# EAGLE design RPinstrumentationAmp1 (EAGLE 9.7.0)
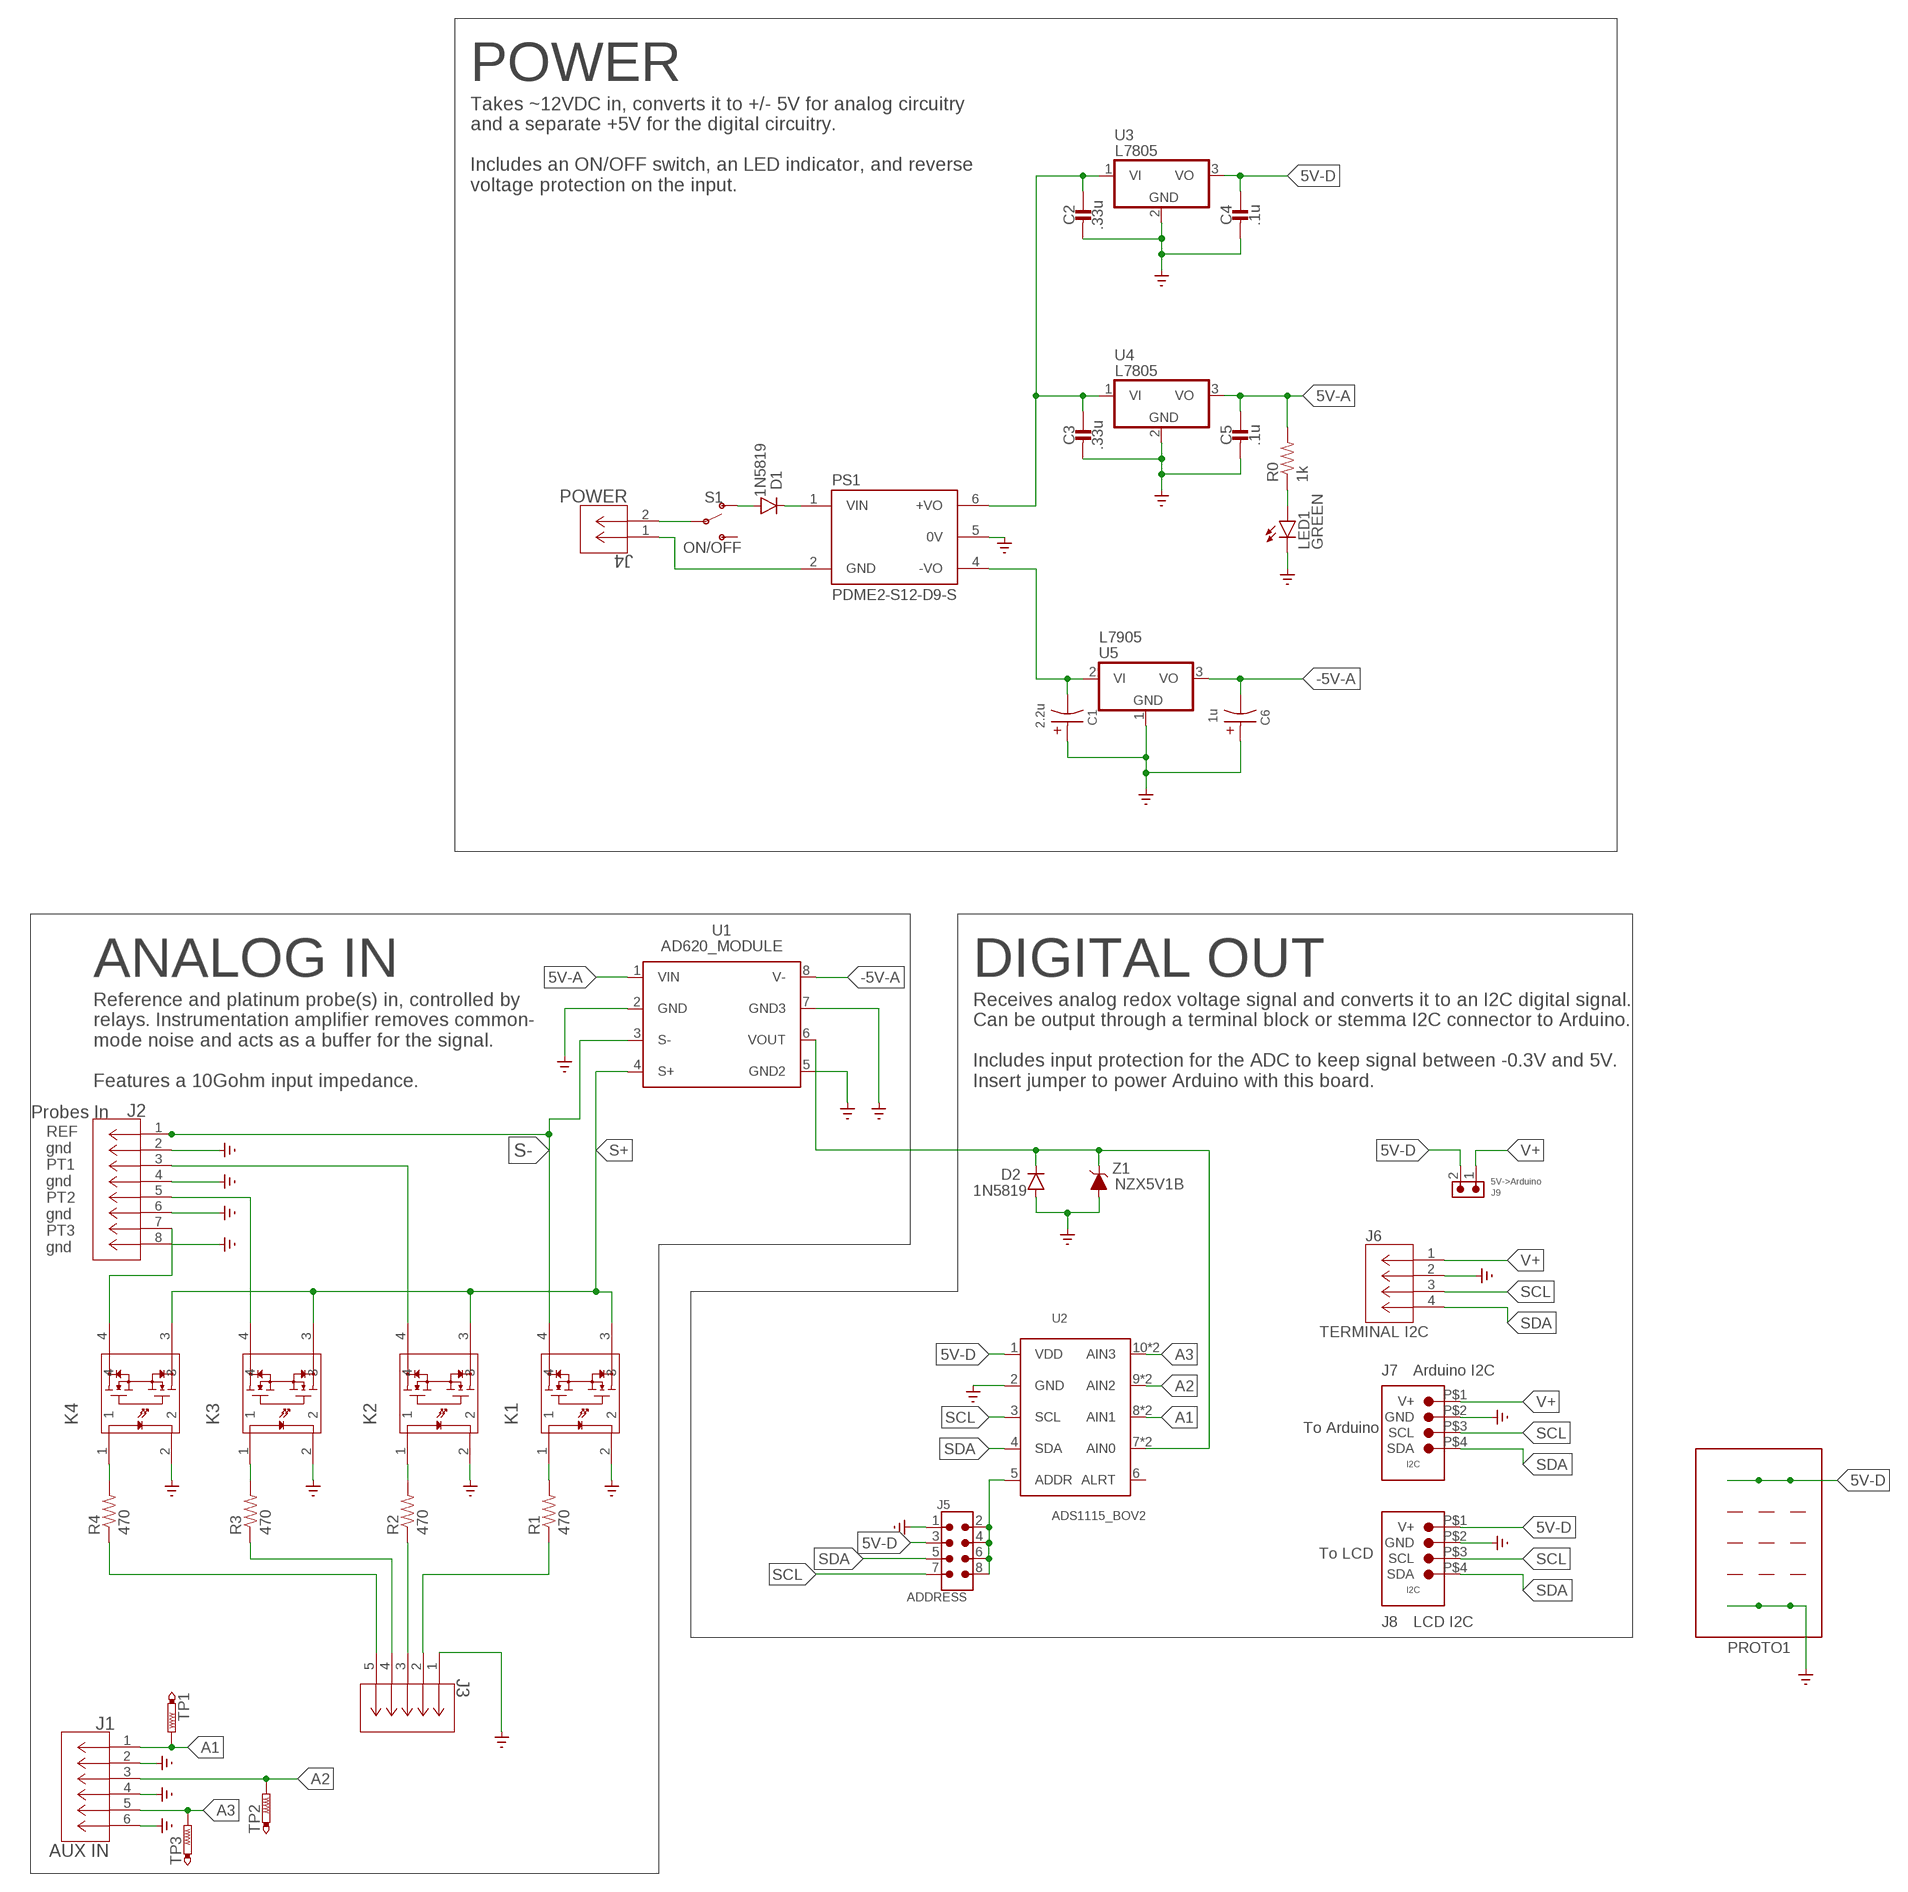
[diagram p0: schematic, sheet 1]

## Parts
C1  2.2u  CAP_POLAR_TH5MM  [E2,5-5]
C2  .33u  CAP-TH-CERAMIC  [THCAPCERAMIC]
C3  .33u  CAP-TH-CERAMIC  [THCAPCERAMIC]
C4  .1u  CAP-TH-CERAMIC  [THCAPCERAMIC]
C5  .1u  CAP-TH-CERAMIC  [THCAPCERAMIC]
C6  1u  CAP_POLAR_TH5MM  [E2,5-5]
D1  1N5819  DIODE-TH  [DIODE-TH]
D2  1N5819  DIODE-TH  [DIODE-TH]
J1  AUX IN  6PIN_TERMINAL_5MM  [6PIN_TERMINAL_5MM]
J2  Probes In  8PIN_TERMINAL_5MM  [8PIN_TERMINAL_5MM]
J3  5PIN_TERMINAL_5MM  [5PIN_TERMINAL_5MM]
J4  POWER  2PIN_TERMINAL_5MM  [CONN2_710002_WRE]
J5  ADDRESS  6130XX21121_61300821121  [61300821121]
J6  TERMINAL I2C  4PIN_TERMINAL_5MM  [4PIN_TERMINAL_5MM]
J7  Arduino I2C  JST_PH_4PIN_STEMMA  [JST_PH_4PIN]
J8  LCD I2C  JST_PH_4PIN_STEMMA  [JST_PH_4PIN]
J9  5V->Arduino  1X2MALEPIN  [61300211121]
K1  G3VM-61A1A-DIP4_THD_OMR  [A-DIP4_THD_OMR]
K2  G3VM-61A1A-DIP4_THD_OMR  [A-DIP4_THD_OMR]
K3  G3VM-61A1A-DIP4_THD_OMR  [A-DIP4_THD_OMR]
K4  G3VM-61A1A-DIP4_THD_OMR  [A-DIP4_THD_OMR]
LED1  GREEN  LED-TH(5MM)  [LED-5MM-TH]
PROTO1  PROTO_AREA_5X3  [PROTO_AREA_5X3]
PS1  PDME2-S12-D9-S  [CONV_PDME2-S12-D9-S]
R0  1k  RESISTOR-TH  [THRESISTOR]
R1  470  RESISTOR-TH  [THRESISTOR]
R2  470  RESISTOR-TH  [THRESISTOR]
R3  470  RESISTOR-TH  [THRESISTOR]
R4  470  RESISTOR-TH  [THRESISTOR]
S1  ON/OFF  SPDT_TT11_TH  [TT11_SPDT]
TP1  PTR1PAD1-13  [P1-13]
TP2  PTR1PAD1-13  [P1-13]
TP3  PTR1PAD1-13  [P1-13]
U1  AD620_MODULE  [AD620_MODULE]
U2  ADS1115_BOV2  [ADS1115_V2]
U3  L7805  7805TV  [TO220V]
U4  L7805  7805TV  [TO220V]
U5  L7905  L79REGULATORTO220V  [TO220V]
Z1  NZX5V1B  ZENER  [DIODE-TH]

## Nets
5V-A: C5.C1 R0.R2 U1.1(VIN) U4.3(VO)
5V-D: C4.C1 J5.3 J8.P$1(V+) J9.2 PROTO1.1 PROTO1.2 PROTO1.3 U2.1(VDD) U3.3(VO)
-5V-A: C6.- U1.8(V-) U5.3(VO)
A1: J1.1 TP1.TP U2.8(AIN1) U2.A1(AIN1)
A2: J1.3 TP2.TP U2.9(AIN2) U2.A2(AIN2)
A3: J1.5 TP3.TP U2.10(AIN3) U2.A3(AIN3)
GND: C1.+ C2.C2 C3.C2 C4.C2 C5.C2 C6.+ D2.P$1(A) J1.2 J1.4 J1.6 J2.2 J2.4 J2.6 J2.8 J3.1 J5.1 J6.2 J7.P$2(GND) J8.P$2(GND) K1.2 K2.2 K3.2 K4.2 LED1.K(C) PROTO1.13 PROTO1.14 PROTO1.15 PS1.5(0V) U1.2(GND) U1.5(GND2) U1.7(GND3) U2.2(GND) U3.2(GND) U4.2(GND) U5.1(GND) Z1.P$1(A) ; supply symbol labelled SUPPLY0_GND_
N$1: D2.P$2(C) U1.6(VOUT) U2.7(AIN0) U2.A0(AIN0) Z1.P$2(C)
N$2: C1.- PS1.4(-VO) U5.2(VI)
N$3: D1.P$2(C) PS1.1(VIN)
N$4: J4.1 PS1.2(GND)
N$5: J2.7 K4.4
N$6: J2.5 K3.4
N$7: C2.C1 C3.C1 PS1.6(+VO) U3.1(VI) U4.1(VI)
N$8: J4.2 S1.P$2(C)
N$9: LED1.A R0.R1
N$10: D1.P$1(A) S1.P$1
N$11: J2.3 K2.4
N$12: K4.1 R4.R2
N$13: J5.2 J5.4 J5.6 J5.8 U2.5(ADDR)
N$14: J3.5 R4.R1
N$15: K3.1 R3.R2
N$16: J3.4 R3.R1
N$17: K2.1 R2.R2
N$18: J3.3 R2.R1
N$19: J3.2 R1.R1
N$20: K1.1 R1.R2
S+: K1.3 K2.3 K3.3 K4.3 U1.4(S+)
S-: J2.1 K1.4 U1.3(S-)
SCL: J5.7 J6.3 J7.P$3(SCL) J8.P$3(SCL) U2.3(SCL)
SDA: J5.5 J6.4 J7.P$4(SDA) J8.P$4(SDA) U2.4(SDA)
V+: J6.1 J7.P$1(V+) J9.1
Unconnected: PROTO1.4 PROTO1.5 PROTO1.6 PROTO1.7 PROTO1.8 PROTO1.9 PROTO1.10 PROTO1.11 PROTO1.12 S1.P$3 U2.6(ALRT)

## Notes on the sheet
- POWER
- Takes ~12VDC in, converts it to +/- 5V for analog circuitry 
  and a separate +5V for the digital circuitry. 
  
  Includes an ON/OFF switch, an LED indicator, and reverse 
  voltage protection on the input.
- ANALOG IN | DIGITAL OUT
- Reference and platinum probe(s) in, controlled by 
  relays. Instrumentation amplifier removes common-
  mode noise and acts as a buffer for the signal.
  
  Features a 10Gohm input impedance.
- Receives analog redox voltage signal and converts it to an I2C digital signal.
  Can be output through a terminal block or stemma I2C connector to Arduino.
  
  Includes input protection for the ADC to keep signal between -0.3V and 5V.
  Insert jumper to power Arduino with this board.
- REF
  gnd
  PT1
  gnd
  PT2
  gnd
  PT3
  gnd
- To Arduino
- To LCD

## Library data of the parts
C1 C6 = !Redox:CAP_POLAR_TH: Elecrolytic Cap, TH
C2-C5 = !Redox:CAP-TH-CERAMIC: Capacitor through-hole ceramic
D1 D2 = !Redox:DIODE-TH: Diode through-hole
J1 = !Redox:6PIN_TERMINAL_5MM: 6 Pin Screw Terminal Block, 5mm pitch
J2 = !Redox:8PIN_TERMINAL_5MM: 8 Pin Screw Terminal Block, 5mm pitch
J3 = !Redox:5PIN_TERMINAL_5MM
J4 = !Redox:2PIN_TERMINAL_5MM; COPYRIGHT: Copyright (C) 2023 Ultra Librarian. All rights reserved.; MANUFACTURER_PART_NUMBER: 691137710002; MFR_NAME: Wurth Electronics
J5 = Wurth_Connectors_WR-PHD:6130XX21121_61300821121: WR-PHD 2.54 mm THT Dual Pin Header ARTICLE PROPERTIES: Pins:4;​ 6;​ 8;​ 10;​ 12;​ 14;​ 16;​ 18;​ 20;​ 22;​ 24;​ 26;​ 28;​ 30;​ 32;​ 34;​ 36;​ 40;​ 44;​ 64;​ 72;​ 80 KIND PROPERTIES: Pitch：2.54 mm Quality Class:3 as per CECC 75 301-802 Rows：Dual Gender：Pin Header Type：Board Stacker MATERIAL PROPERTIES: Insulator Material :PA6T Insulator Flammability Rating:UL94 V-0 Contact Material:Copper Alloy Contact Plating:Gold Contact Type:Stamped GENERAL INFORMATION Operating Temperature:-40 up to +105 °C Compliance:Lead free / RoHS ELECTRICAL PROPERTIES: Rated Current:3 A IR 1:3 A Withstanding Voltage:500 V (AC) Contact Resistance:20 mΩ RISO:1000 MΩ CERTIFICATION UL Approval:E323964 PACKAGING PROPERTIES Packaging:Bag <https://katalog.we-online.com/media/images/v2/o33215v209%20Family_WR-PHD_6130xx21121.jpg> Details see: https://katalog.we-online.com/en/em/PHD_2_54_THT_DUAL_PIN_HEADER_6130XX21121 Updated by Yingchun,Shan 2019-10-16 2019 (C) Würth Elektronik; DATASHEET-URL: https://www.we-online.com/catalog/datasheet/61300821121.pdf; GENDER: Pin Header; IR: 3A; MOUNT: THT; PACKAGING: Bag; PART-NUMBER: 61300821121; PINS: 8; PITCH: 2.54mm; ROWS: Dual; TYPE: Board Stacker; VALUE: 61300821121
J6 = !Redox:4PIN_TERMINAL_5MM: 4 Pin Terminal Block, 5mm pitch
J7 J8 = !Redox:JST_PH_4PIN_STEMMA: STEMMA 4 pin connector for I2C communication V+ GND SCL DSA
J9 = !Redox:1X2MALEPIN: 1x2 pin header 2.54mm pitch
K1-K4 = G3VM-61A1D1_Library_SSR:G3VM-61A1; COPYRIGHT: Copyright (C) 2024 Ultra Librarian. All rights reserved.; MANUFACTURER_PART_NUMBER: G3VM-61A1; MFR_NAME: Omron
LED1 = !Redox:LED-TH(5MM): LED 5mm through hole
PROTO1 = !Redox:PROTO_AREA_5X3: 5x3 Prototyping Area
PS1 = PDME2-S12-D9-S:PDME2-S12-D9-S; MANUFACTURER: CUI Inc; MAXIMUM_PACKAGE_HEIGHT: 10.41 mm; PARTREV: 1.0; STANDARD: Manufacturer Recommendations
R0 R1-R4 = !Redox:RESISTOR-TH: Through-hole Resistor
S1 = !Redox:SPDT_TT11_TH: TT11 DPST toggle switch, Through-Hole
TP1-TP3 = testpad:PTR1: TEST PIN
U1 = !Redox:AD620_MODULE: AD620 Instumentation Amplifier Module (breakout board)
U2 = !Redox:ADS1115_BO: ADS1115 breakout board. 16-bit ADC, 1x10 through hole (pin header)
U3 U4 = !Redox:78*: Positive VOLTAGE REGULATOR Source: http://cache.national.com/ds/LM/LM78L05.pdf http://www.fairchildsemi.com/ds/LM/LM7805.pdf
U5 = !Redox:L79*REGULATOR: Negative VOLTAGE REGULATOR
Z1 = !Redox:ZENER: Zener Diode, Through-Hole

## Board
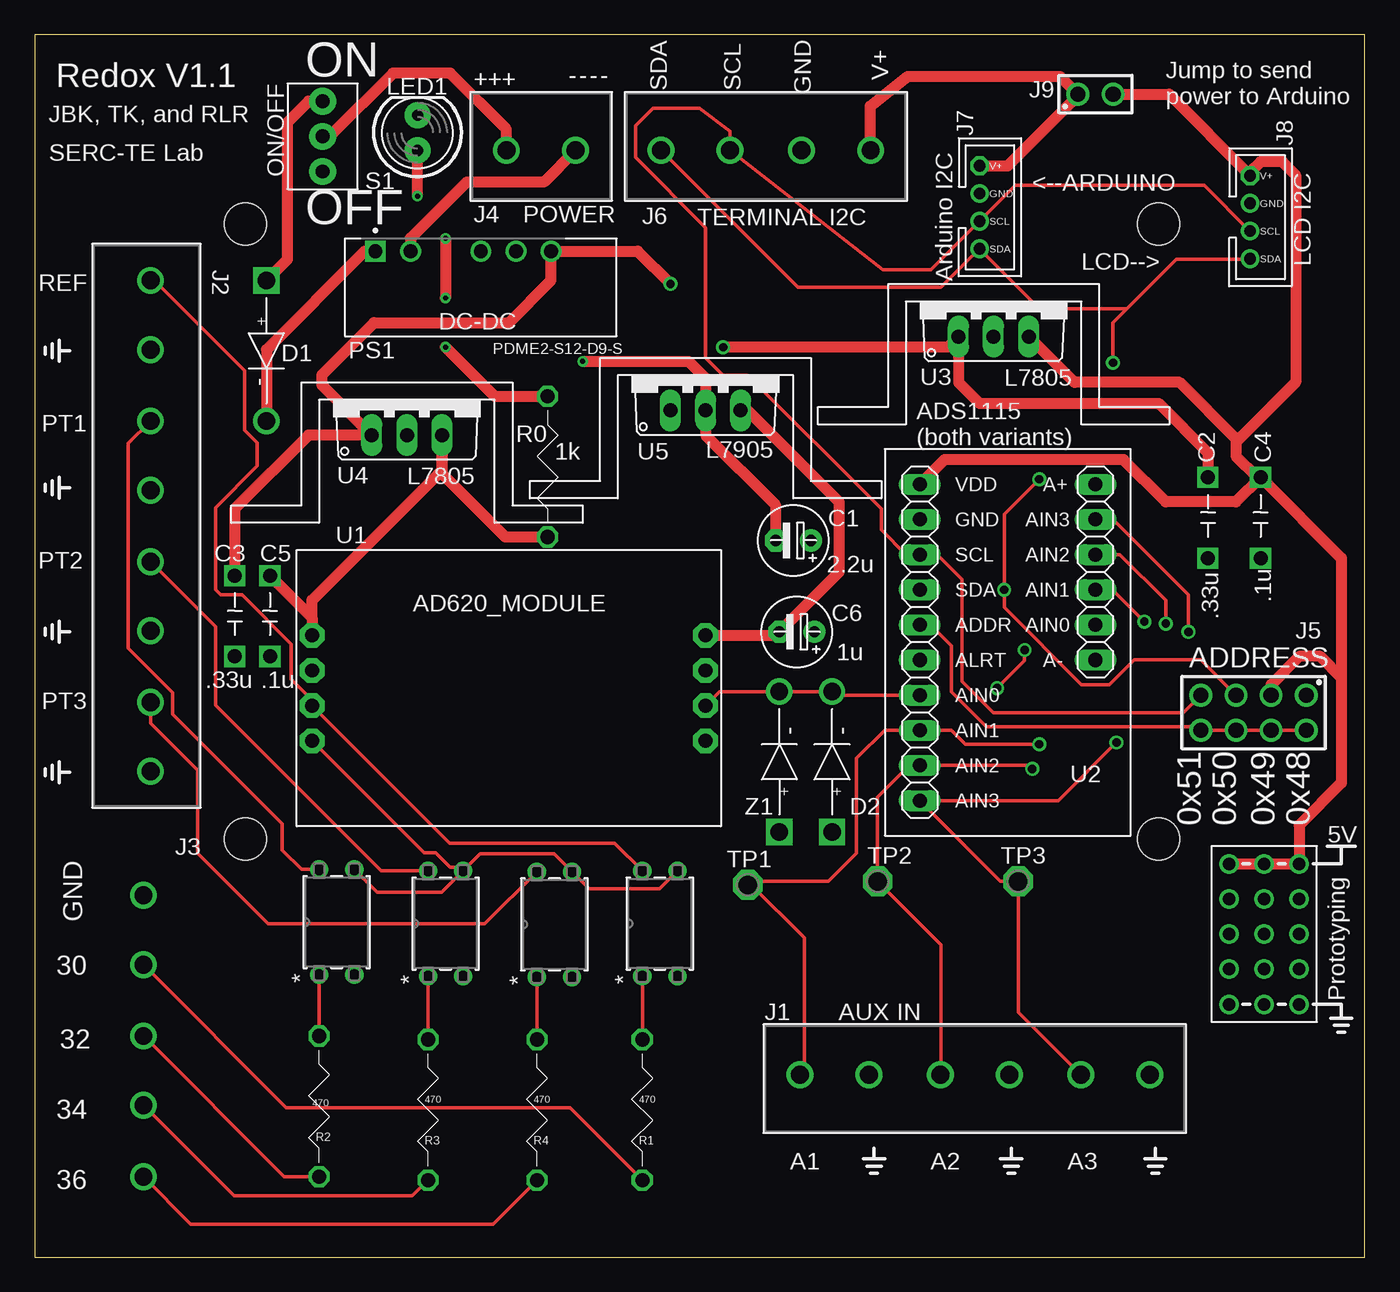
[diagram p1: board, top side]
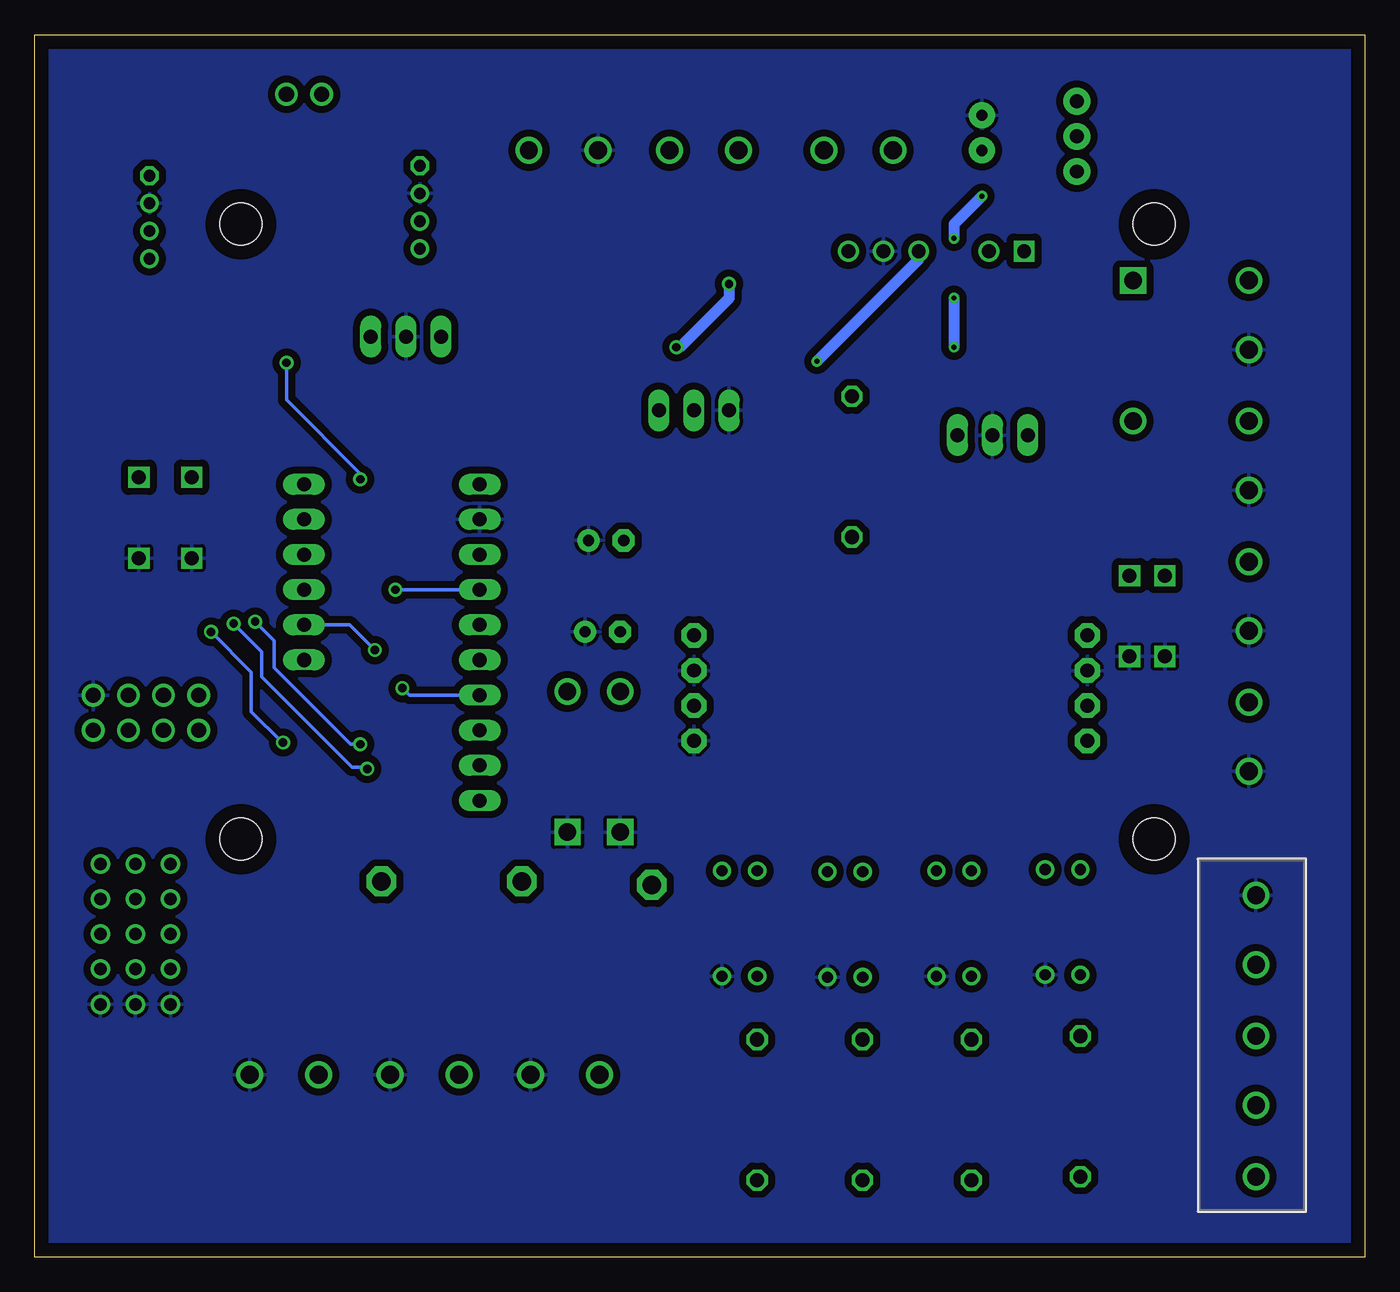
[diagram p2: board, bottom side, seen from below]

Size 96.19 x 88.38 mm. Coordinates in mm from the lower left corner, seen from the top.
Outline: 0,0 96.19,0 96.19,88.38 0,88.38 0,0
Copper layers (1*16): Top 0.035mm / dielectric 1.5mm / Bottom 0.035mm
Design rules "OSH": minimum track width 6mil, minimum drill 0.35mm, track to track 20mil, track to pad 20mil, pad to pad 20mil, via to via 20mil, smd to smd 6mil, copper to edge 40mil, drill to drill 6mil, minimum pad ring 10mil, minimum via ring 8mil, stop-mask expansion 4mil, vias tented up to drill 0mil, thermal gap 10mil
Holes 3.05 mm at 81.28,30.23 15.24,74.68 81.28,74.68 15.24,30.23

### Footprints (pad centres in the part's own frame; a part is rotated, then mirrored left to right if it is on the bottom)
E2,5-5 = drill 0.813 pad 1.6: + -1.27,0 | drill 0.813 pad 1.6 octagon: - 1.27,0
THCAPCERAMIC = drill 1.016 square: C1 -2.794,0; C2 3.048,0
DIODE-TH = drill 1.27 square: P$1 0,0 | drill 1.27: P$2 0,-10.16
6PIN_TERMINAL_5MM = drill 1.295 pad 1.803: 1 -12.7,0; 2 -7.696,0; 3 -2.54,0; 4 2.464,0; 5 7.62,0; 6 12.624,0
8PIN_TERMINAL_5MM = drill 1.295 pad 1.803: 1 0,0; 2 5.004,0; 3 10.16,0; 4 15.164,0; 5 20.32,0; 6 25.324,0; 7 30.48,0; 8 35.484,0
5PIN_TERMINAL_5MM = drill 1.295 pad 1.803: 1 -12.7,0; 2 -7.696,0; 3 -2.54,0; 4 2.464,0; 5 7.62,0
CONN2_710002_WRE = drill 1.295 pad 1.803: 1 0,0; 2 5.004,0
61300821121 = drill 1.1: 1 -3.81,-1.27; 2 -3.81,1.27; 3 -1.27,-1.27; 4 -1.27,1.27; 5 1.27,-1.27; 6 1.27,1.27; 7 3.81,-1.27; 8 3.81,1.27
4PIN_TERMINAL_5MM = drill 1.295 pad 1.803: 1 -7.62,0; 2 -2.616,0; 3 2.54,0; 4 7.544,0
JST_PH_4PIN = drill 0.85 octagon: P$1 -3,0 | drill 0.85: P$2 -1,0; P$3 1,0; P$4 3,0
61300211121 = drill 1.1: 1 -1.27,0; 2 1.27,0
A-DIP4_THD_OMR = drill 0.813 pad 1.321: 1 0,0; 2 0,-2.54; 3 7.62,-2.54; 4 7.62,0
LED-5MM-TH = drill 0.813 pad 1.88: A -1.27,0; K 1.27,0
PROTO_AREA_5X3 = drill 0.9: 1 0,0; 2 2.54,0; 3 5.08,0; 4 0,-2.54; 5 2.54,-2.54; 6 5.08,-2.54; 7 0,-5.08; 8 2.54,-5.08; 9 5.08,-5.08; 10 0,-7.62; 11 2.54,-7.62; 12 5.08,-7.62; 13 0,-10.16; 14 2.54,-10.16; 15 5.08,-10.16
CONV_PDME2-S12-D9-S = drill 1 square: 1 -7.615,2.625 | drill 1: 2 -5.075,2.625; 4 0.005,2.625; 5 2.545,2.625; 6 5.085,2.625
THRESISTOR = drill 1.016 octagon: R1 -5.08,0; R2 5.08,0
TT11_SPDT = drill 1 pad 1.93: P$1 -2.54,0; P$2 0,0; P$3 2.54,0
P1-13 = drill 1.321 pad 2.159 octagon: TP 0,0
AD620_MODULE = drill 1 pad 1.778 octagon: 1 -15.24,3.81; 2 -15.24,1.27; 3 -15.24,-1.27; 4 -15.24,-3.81; 5 13.208,-3.81; 6 13.208,-1.27; 7 13.208,1.27; 8 13.208,3.81
ADS1115_V2 = drill 1.016 long: 1 -11.43,0; 2 -8.89,0; 3 -6.35,0; 4 -3.81,0; 5 -1.27,0; 6 1.27,0; 7 3.81,0; 8 6.35,0; 9 8.89,0; 10 11.43,0; A0 -1.27,12.7; A1 -3.81,12.7; A2 -6.35,12.7; A3 -8.89,12.7; A+ -11.43,12.7; A- 1.27,12.7
TO220V = drill 1.016 long: 1 -2.54,-2.54; 2 0,-2.54; 3 2.54,-2.54

### Placement (x,y rotation side)
C1  54.86,51.82 180 top
C2  84.84,53.59 270 top
C3  14.48,46.48 270 top
C4  88.65,53.59 270 top
C5  17.02,46.48 270 top
C6  55.12,45.21 180 top
D1  16.76,70.61 0 top
D2  57.66,30.73 180 top
J1  68.03,13.21 0 top
J2  8.38,70.61 270 top
J3  7.87,13.46 270 bottom
J4  39.12,80.01 180 top
J5  88.14,39.37 180 top
J6  52.83,80.01 180 top
J7  68.33,75.9 270 top
J8  87.88,75.18 270 top
J9  76.71,84.07 0 top
K1  43.94,20.32 90 top
K2  20.57,20.42 90 top
K3  28.45,20.32 90 top
K4  36.32,20.26 90 top
LED1  27.69,81.28 90 top
PROTO1  86.36,28.45 0 top
PS1  32.26,70.1 0 top
R0  37.08,57.15 270 top
R1  43.94,10.67 90 top
R2  20.57,10.92 90 top
R3  28.45,10.67 90 top
R4  36.32,10.67 90 top
S1  20.83,81.03 270 top
TP1  51.56,26.92 0 top
TP2  60.96,27.18 0 top
TP3  71.12,27.18 0 top
U1  35.31,41.15 0 top
U2  64.01,44.45 270 top
U3  69.34,69.09 0 top
U4  26.92,61.98 0 top
U5  48.51,63.75 0 top
Z1  53.85,30.73 180 top

### Tracks (layer width: path | path; a pad name or v marks a point on that pad's centre or on a via)
5V-A
  Top 0.813: 20.07,46.23 C5.C1 | 20.07,46.23 20.07,47.5 29.46,56.9 U4.3 29.46,56.64 34.04,52.07 R0.R2 | 20.07,46.23 U1.1
5V-D
  Top 0.813: U2.1 65.79,57.66 78.74,57.66 81.79,54.61 86.87,54.61 C4.C1 | J9.2 82.04,84.07 87.88,78.23 J8.P$1 87.88,78.44 88.65,79.2 90.22,79.2 91.19,78.23 91.19,63.25 86.87,58.93 | U3.3 75.18,63.25 82.8,63.25 86.87,59.18 86.87,58.93 | 86.87,58.93 86.87,57.91 88.39,56.39 C4.C1 | J5.3 89.41,41.4 91.44,43.43 92.96,43.43 94.49,41.91 | 94.49,41.91 94.49,34.29 91.44,31.24 PROTO1.3 PROTO1.2 PROTO1.1 | C4.C1 94.49,50.55 94.49,41.91
-5V-A
  Top 0.813: U5.3 51.56,61.21 58.17,54.61 58.17,49.53 C6.- 53.59,44.96 U1.8
A1  (via drill 0.6)
  Top 0.254: v72.64,37.08 67.31,37.08 66.29,38.1 U2.8 61.47,38.1 59.44,36.07 59.44,29.21 57.4,27.18 51.56,27.18 51.31,26.92 TP1.TP 51.82,26.92 55.65,23.09 55.65,13.53 J1.1 | v80.25,45.96 77.95,48.26 U2.A1
  Bottom 0.254: v72.64,37.08 73.35,37.08 78.87,42.6 78.87,44.58 v80.25,45.96
A2  (via drill 0.6)
  Top 0.254: v72.14,35.31 71.88,35.56 U2.9 63.25,35.56 60.96,33.27 TP2.TP 65.53,22.61 65.53,13.21 J1.3 | v81.79,45.81 81.79,47.5 78.49,50.8 U2.A2
  Bottom 0.254: v72.14,35.31 72.27,35.44 73.22,35.44 79.76,41.97 79.76,43.77 v81.79,45.81
A3  (via drill 0.6)
  Top 0.254: v78.23,37.22 74.04,33.02 U2.10 69.85,27.18 TP3.TP 71.12,17.74 J1.5 | v83.43,45.21 83.43,47.88 77.98,53.34 U2.A3
  Bottom 0.254: v78.23,37.22 78.3,37.22 80.52,39.43 80.52,42.3 v83.43,45.21
GND
  pour Bottom: 0.51,0.76 95.76,0.76 95.76,87.88 0.51,87.88
N$1  (via drill 0.6)
  Top 0.254: U1.6 49.53,40.89 Z1.P$2 D2.P$2 57.91,40.64 U2.7 | v69.6,41.15 71.58,43.14 v71.58,43.9
  Bottom 0.254: U2.7 69.09,40.64 v69.6,41.15 | v71.58,43.9 73.41,45.72 U2.A0
N$2  (via drill 0.35)
  Top 0.813: C1.- 53.59,54.36 48.51,59.44 U5.2 48.51,63.55 47.3,64.77 v39.62,64.77
  Bottom 0.813: PS1.4 32.26,72.14 v39.62,64.77
N$3
  Top 0.813: PS1.1 23.88,72.73 16.76,65.61 D1.P$2
N$4
  Top 0.813: J4.1 36.83,77.72 31.24,77.72 27.18,73.66 PS1.2
N$5
  Top 0.254: K4.4 32.55,24.1 22.43,24.1 16.87,24.1 11.78,29.2 11.78,35.22 8.38,38.62 J2.7
N$6
  Top 0.254: J2.5 13.08,45.59 13.08,39.91 25.05,27.94 K3.4
N$7  (via drill 0.6)
  Top 0.813: C3.C1 14.48,54.1 19.81,59.44 U4.1 20.78,63.04 20.78,63.79 24.55,67.56 34.29,67.56 37.34,70.62 PS1.6 43.6,72.73 v45.97,70.36 | v49.78,65.79 66.04,65.79 U3.1 66.8,63.25 68.33,61.72 81.28,61.72 84.84,58.17 C2.C1
  Bottom 0.813: v49.78,65.79 49.53,65.79 45.97,69.34 v45.97,70.36
N$8
  Top 0.813: S1.P$2 21.34,81.03 25.91,85.6 30.05,85.6 34.11,81.53 J4.2
N$9  (via drill 0.35)
  Top 0.813: v27.69,76.71 LED1.A | v29.72,73.66 v29.72,69.34 | v29.72,65.79 33.27,62.23 R0.R1
  Bottom 0.813: v27.69,76.71 29.72,74.68 v29.72,73.66 | v29.72,69.34 v29.72,65.79
N$10
  Top 0.813: D1.P$1 18.29,72.14 18.29,82.04 19.81,83.57 S1.P$1
N$11
  Top 0.254: J2.3 6.78,58.84 6.78,44.01 9.99,40.8 9.99,39.25 17.91,31.33 17.91,29.43 19.29,28.04 K2.4
N$12
  Top 0.254: K4.1 R4.R2
N$13
  Top 0.254: J5.2 J5.4 J5.6 J5.8 84.07,38.35 68.83,38.35 66.29,40.89 66.29,44.2 64.77,45.72 U2.5
N$14
  Top 0.254: R4.R1 33.15,2.41 11.3,2.41 J3.5
N$15
  Top 0.254: K3.1 R3.R2
N$16
  Top 0.254: R3.R1 27.31,4.44 14.43,4.44 J3.4
N$17
  Top 0.254: R2.R2 K2.1
N$18
  Top 0.254: R2.R1 18.03,5.84 J3.3
N$19
  Top 0.254: J3.2 18.21,10.83 38.7,10.83 R1.R1
N$20
  Top 0.254: K1.1 R1.R2
S+
  Top 0.254: K2.3 24.77,26.39 29.44,26.39 K3.3 31.24,28.19 | K1.3 45.19,26.64 40.09,26.64 K4.3 37.57,29.17 32.22,29.17 31.24,28.19 | U1.4 28.17,29.23 28.99,29.23 30.03,28.19 31.24,28.19
S-
  Top 0.254: J2.1 8.64,70.61 15.18,64.07 15.18,59.79 16.11,58.87 16.11,57.2 13.08,54.18 13.08,48.25 13.45,47.88 15,47.88 18.54,44.33 18.54,41.79 20.07,40.26 U1.3 30.01,29.93 41.95,29.93 K1.4
SCL
  Top 0.254: J5.7 83.06,39.37 69.34,39.37 67.06,41.66 67.06,49.02 65.28,50.8 U2.3 62.99,50.8 61.21,52.58 61.21,54.1 51.56,63.75 49.78,63.75 48.51,65.02 48.51,74.42 43.43,79.5 43.43,81.79 44.7,83.06 48.08,83.06 50.29,81.39 J6.3 61.33,71.37 64.8,71.37 J7.P$3 70.91,77.49 84.58,77.49 J8.P$3
SDA  (via drill 0.6)
  Top 0.254: J6.4 55.19,70.1 65.53,70.1 J7.P$4 72.64,68.58 78.99,68.58 | J5.5 84.33,43.18 79.5,43.18 77.72,41.4 75.69,41.4 70.1,46.99 v70.1,48.26 70.1,53.7 v72.64,56.24 | J8.P$4 87.83,72.14 82.55,72.14 78.99,68.58 | v77.98,64.66 77.98,67.56 78.99,68.58
  Bottom 0.254: v70.1,48.26 U2.4 | v77.98,64.66 77.98,61.98 72.64,56.64 v72.64,56.24
V+
  Top 0.813: J6.1 60.45,83.21 60.43,83.21 63.11,85.34 74.17,85.34 J9.1 75.44,83.98 70.36,78.9 J7.P$1

### Text on the board
tPlace: ON | - | - | - | - | V+ | Redox V1.1 | + | + | + | SDA | SCL | GND | Jump to send / power to Arduino | JBK, TK, and RLR | SERC-TE Lab | OFF | REF | <--ARDUINO / / / LCD--> | DC-DC | PT1 | ADS1115 / (both variants) | PT2 | PT3 | 0x51 | 0x50 | 0x49 | 0x48 | 5V | GND | 30 | Prototyping | 32 | 34 | 36 | A1 | A2 | A3